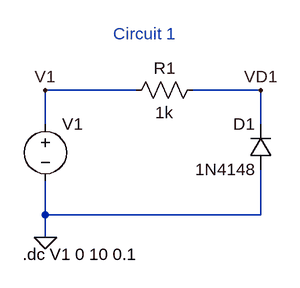
[diagram p0: schematic 2EEB_VELASCO_EXPT2_CKT1.asc]
2EEB_VELASCO_EXPT2_CKT1.asc, the LTspice schematic file:
Version 4
SHEET 1 880 680
WIRE 176 48 48 48
WIRE 352 48 256 48
WIRE 48 96 48 48
WIRE 352 96 352 48
WIRE 48 224 48 176
WIRE 352 224 352 160
WIRE 352 224 48 224
WIRE 48 256 48 224
FLAG 48 48 V1
FLAG 352 48 VD1
FLAG 48 256 0
SYMBOL voltage 48 80 R0
SYMATTR InstName V1
SYMATTR Value ""
SYMBOL res 272 32 R90
WINDOW 0 0 56 VBottom 2
WINDOW 3 32 56 VTop 2
SYMATTR InstName R1
SYMATTR Value 1k
SYMBOL diode 368 160 R180
WINDOW 0 24 64 Left 2
WINDOW 3 24 0 Left 2
SYMATTR InstName D1
SYMATTR Value 1N4148
TEXT 16 280 Left 2 !.dc V1 0 10 0.1
TEXT 144 -32 Left 2 ;Circuit 1

The netlist it stands for:
* 2EEB_VELASCO_EXPT2_CKT1.asc
V1 V1 0
R1 VD1 V1 1k
D1 0 VD1 1N4148
.model D D
.lib standard.dio
.dc V1 0 10 0.1
* Circuit 1
.backanno
.end